# Altium project EzPowerV4 - REV09.PrjPcb (part 3 of 7)

## Sheet ESP32 WI-FI Module.SchDoc: ESP32 WI-FI Module
size A2; ApprovedBy: JTS; CheckedBy: JTS; DrawnBy: EBC; DocumentNumber: -; Revision: 09; SheetNumber: 6; SheetTotal: 7; SenaiProjectName: EzPower v4
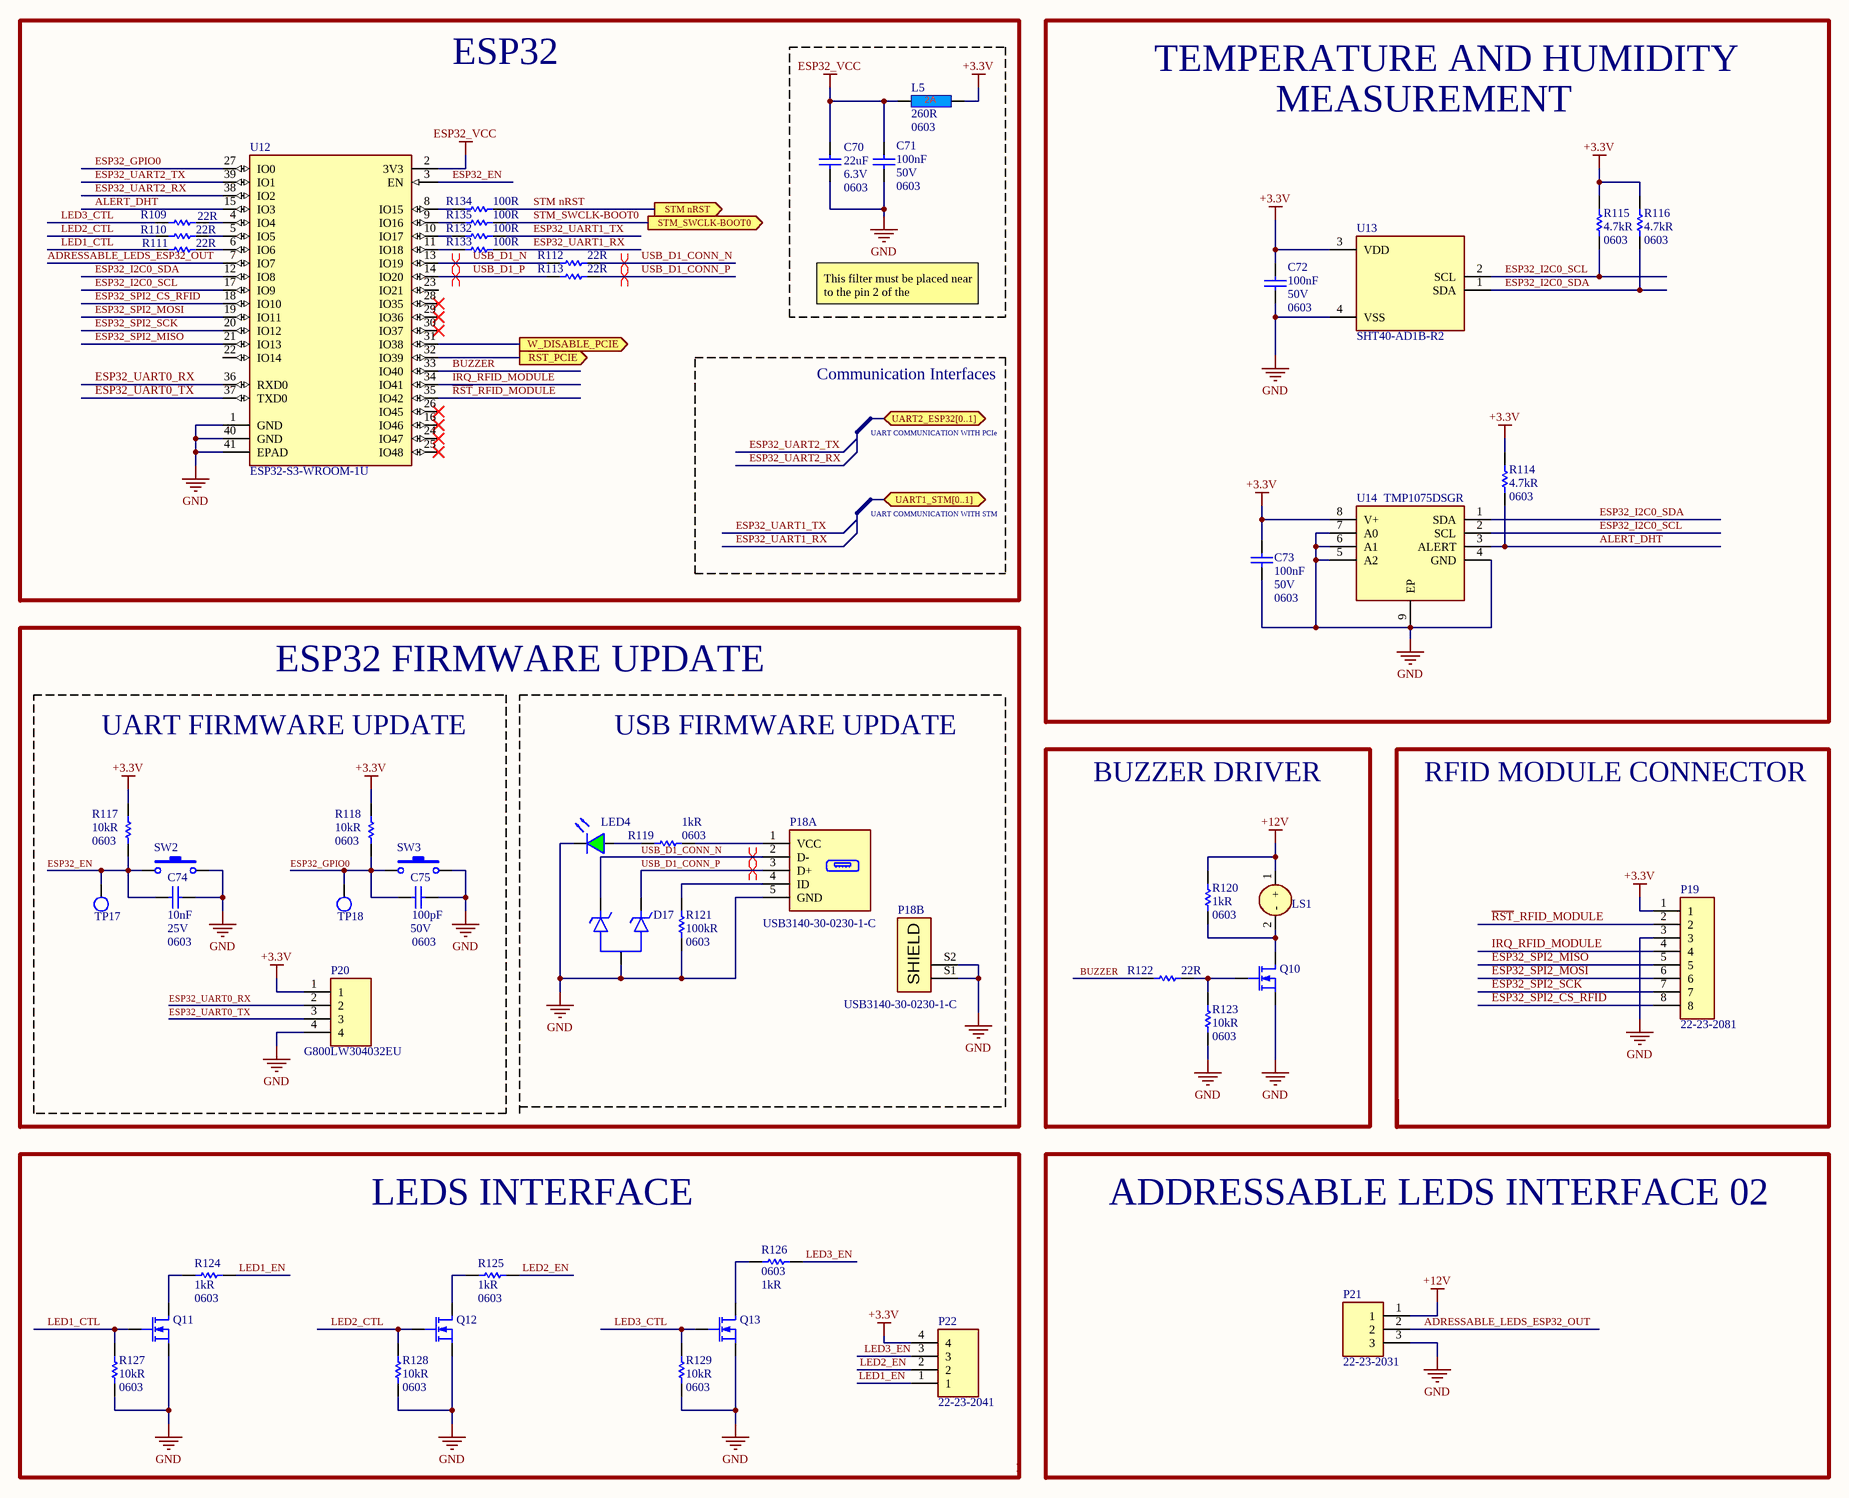
[diagram p5: ESP32 WI-FI Module.SchDoc]

### Parts
C70  Case/Package: 0603  Voltage Rating (DC): 6.3V  Capacitance: 22uF  [C0603]  (hidden comment: C_0603_22uF_6.3V_20%)
C71  value 100nF  Case/Package: 0603  Voltage Rating: 50V  [C0603]  (hidden comment: CC0603MRX7R9BB104)
C72  value 100nF  Case/Package: 0603  Voltage Rating: 50V  [C0603]  (hidden comment: CC0603MRX7R9BB104)
C73  value 100nF  Case/Package: 0603  Voltage Rating: 50V  [C0603]  (hidden comment: CC0603MRX7R9BB104)
C74  Voltage Rating: 25V  Capacitance: 10nF  Case Code (Imperial): 0603  [C0603]  (hidden comment: C_0603_0.01uF_25V_10%)
C75  value 100pF  Voltage: 50V  Case/Package: 0603  [C0603]  (hidden comment: CL10C101JB8NNNC)
D17  RCLAMP0502BATCT  [SC-75-3]  (value not drawn)
L5  Case Code: 0603  Output Impedance: 260R  [L0603]  (hidden comment: BLM18EG221SN1D)
LED4  LED 0603 SMD GREEN  [LED0603-GREEN]  (value not drawn)
LS1  PS1240P02BT  [BZ_12mm]  (value not drawn)
P18  USB3140-30-0230-1-C  [CONN-MICROUSB-VERT]  (parts A,B of 2)
P19  22-23-2081  [HEADER_KK_2.54MM_8POS]
P20  G800LW304032EU  [HEADER_2.54MM_4POS]
P21  22-23-2031  [HEADER_2.54MM_3POS]
P22  22-23-2041  [HEADER_KK_2.54MM_4POS]
Q10  RSF015N06FRATL  [TUMT-3]  (value not drawn)
Q11  RSF015N06FRATL  [TUMT-3]  (value not drawn)
Q12  RSF015N06FRATL  [TUMT-3]  (value not drawn)
Q13  RSF015N06FRATL  [TUMT-3]  (value not drawn)
R109  Resistance: 22R  [R0603]  (hidden comment: CRCW060322R0FKEAC)
R110  Resistance: 22R  [R0603]  (hidden comment: CRCW060322R0FKEAC)
R111  Resistance: 22R  [R0603]  (hidden comment: CRCW060322R0FKEAC)
R112  Resistance: 22R  [R0603]  (hidden comment: CRCW060322R0FKEAC)
R113  Resistance: 22R  [R0603]  (hidden comment: CRCW060322R0FKEAC)
R114  Case Code (Imperial): 0603  Resistance: 4.7kR  [R0603]  (hidden comment: R_0603_4.7k_1%_1/10W)
R115  Case Code (Imperial): 0603  Resistance: 4.7kR  [R0603]  (hidden comment: R_0603_4.7k_1%_1/10W)
R116  Case Code (Imperial): 0603  Resistance: 4.7kR  [R0603]  (hidden comment: R_0603_4.7k_1%_1/10W)
R117  value 10kR  Case/Package: 0603  [R0603]  (hidden comment: CRCW060310K0JNEBC)
R118  value 10kR  Case/Package: 0603  [R0603]  (hidden comment: CRCW060310K0JNEBC)
R119  Size Code: 0603  Resistance: 1kR  [R0603]  (hidden comment: R_0603_1kR_1%_1/10W)
R120  Size Code: 0603  Resistance: 1kR  [R0603]  (hidden comment: R_0603_1kR_1%_1/10W)
R121  Case/Package: 0603  Resistance: 100kR  [R0603]  (hidden comment: RC0603FR-07100KL)
R122  Resistance: 22R  [R0603]  (hidden comment: CRCW060322R0FKEAC)
R123  value 10kR  Case/Package: 0603  [R0603]  (hidden comment: CRCW060310K0JNEBC)
R124  Size Code: 0603  Resistance: 1kR  [R0603]  (hidden comment: R_0603_1kR_1%_1/10W)
R125  Size Code: 0603  Resistance: 1kR  [R0603]  (hidden comment: R_0603_1kR_1%_1/10W)
R126  Size Code: 0603  Resistance: 1kR  [R0603]  (hidden comment: R_0603_1kR_1%_1/10W)
R127  value 10kR  Case/Package: 0603  [R0603]  (hidden comment: CRCW060310K0JNEBC)
R128  value 10kR  Case/Package: 0603  [R0603]  (hidden comment: CRCW060310K0JNEBC)
R129  value 10kR  Case/Package: 0603  [R0603]  (hidden comment: CRCW060310K0JNEBC)
R132  value 100R  [R0603]  (hidden comment: CRT0603-FY-1000ELF)
R133  value 100R  [R0603]  (hidden comment: CRT0603-FY-1000ELF)
R134  value 100R  [R0603]  (hidden comment: CRT0603-FY-1000ELF)
R135  value 100R  [R0603]  (hidden comment: CRT0603-FY-1000ELF)
SW2  PTS810SJM250SMTRLFS  [PUSH BUTTON 4.2mm x 3.2 mm]  (value not drawn)
SW3  PTS810SJM250SMTRLFS  [PUSH BUTTON 4.2mm x 3.2 mm]  (value not drawn)
TP17  TP_SMT_CIRCLE  [Test Point 1.5 mm]  (value not drawn)
TP18  TP_SMT_CIRCLE  [Test Point 1.5 mm]  (value not drawn)
U12  U_ESP32-S3-WROOM-1U  [ESP32-S3-WROOM-1U]  (value not drawn)
U13  SHT40-AD1B-R2  [DFN-4]
U14  TMP1075DSGR  [WSON8]

### Blocks framed on the sheet
ESP32: C70 C71 L5 R109-R113 R132-R135 U12
ESP32 FIRMWARE UPDATE: C74 C75 P20 R117 R118 SW2 SW3 TP17 TP18
BUZZER DRIVER: LS1 Q10 R120 R122 R123
ADDRESSABLE LEDS INTERFACE 02: P21

### Ports
RST_PCIE (out), STM nRST (out), STM_SWCLK-BOOT0 (out), UART1_STM[0..1] (bidir), UART2_ESP32[0..1] (bidir), W_DISABLE_PCIE (out)

### Nets
+3.3V: C72.1 C73.1 L5.2 P19.1 P20.1 P22.4 R114.2 R115.2 R116.2 R117.2 R118.2 U13.3(VDD) U14.8(V+)
+12V: LS1.1(+) P21.1 R120.1
ESP32_VCC: C70.2 C71.1 L5.1 U12.2(3V3)
GND: C70.1 C71.2 C72.2 C73.2 C74.1 C75.2 D17.3(A) LED4.2(K) P18.5(GND) P18.S1(SHIELD) P18.S2(SHIELD) P19.3 P20.4 P21.3 Q10.2(S) Q11.2(S) Q12.2(S) Q13.2(S) R121.1 R123.1 R127.1 R128.1 R129.1 SW2.3 SW3.3 U12.1(GND) U12.40(GND) U12.41(EPAD) U13.4(VSS) U14.4(GND) U14.5(A2) U14.6(A1) U14.7(A0) U14.9(EP)  [project net EARTH]
ADRESSABLE_LEDS_ESP32_OUT: P21.2 U12.7(IO7)
ALERT_DHT: R114.1 U12.15(IO3) U14.3(ALERT)
BUZZER: R122.2 U12.33(IO40)
ESP32_EN: C74.2 R117.1 SW2.1 TP17.1 U12.3(EN)
ESP32_GPIO0: C75.1 R118.1 SW3.1 TP18.1 U12.27(IO0)
ESP32_I2C0_SCL: R115.1 U12.17(IO9) U13.2(SCL) U14.2(SCL)
ESP32_I2C0_SDA: R116.1 U12.12(IO8) U13.1(SDA) U14.1(SDA)
ESP32_SPI2_CS_RFID: P19.8 U12.18(IO10)
ESP32_SPI2_MISO: P19.5 U12.21(IO13)
ESP32_SPI2_MOSI: P19.6 U12.19(IO11)
ESP32_SPI2_SCK: P19.7 U12.20(IO12)
ESP32_UART0_RX: P20.2 U12.36(RXD0)
ESP32_UART0_TX: P20.3 U12.37(TXD0)
ESP32_UART1_RX: R133.2
ESP32_UART1_TX: R132.2
ESP32_UART2_RX: U12.38(IO2)
ESP32_UART2_TX: U12.39(IO1)
IRQ_RFID_MODULE: P19.4 U12.34(IO41)
LED1_CTL: Q11.1(G) R111.2 R127.2
LED1_EN: P22.1 R124.2
LED2_CTL: Q12.1(G) R110.2 R128.2
LED2_EN: P22.2 R125.2
LED3_CTL: Q13.1(G) R109.2 R129.2
LED3_EN: P22.3 R126.2
~{RST}_RFID_MODULE: P19.2 U12.35(IO42)
STM nRST: R134.2 ; port STM nRST
STM_SWCLK-BOOT0: R135.2 ; port STM_SWCLK-BOOT0
USB_D1_CONN_N: D17.1(K) P18.2(D-) R112.2
USB_D1_CONN_P: D17.2(K) P18.3(D+) R113.2
USB_D1_N: R112.1 U12.13(IO19)
USB_D1_P: R113.1 U12.14(IO20)
NetLED4_1: LED4.1(A) R119.2
NetLS1_2: LS1.2(-) Q10.3(D) R120.2
NetP18_1: P18.1(VCC) R119.1
NetP18_4: P18.4(ID) R121.2
NetQ10_1: Q10.1(G) R122.1 R123.2
NetQ11_3: Q11.3(D) R124.1
NetQ12_3: Q12.3(D) R125.1
NetQ13_3: Q13.3(D) R126.1
NetR21_1: U12.31(IO38) ; port W_DISABLE_PCIE
NetR24_1: U12.32(IO39) ; port RST_PCIE
NetR109_1: R109.1 U12.4(IO4)
NetR110_1: R110.1 U12.5(IO5)
NetR111_1: R111.1 U12.6(IO6)
NetR132_1: R132.1 U12.10(IO17)
NetR133_1: R133.1 U12.11(IO18)
NetR134_1: R134.1 U12.8(IO15)
NetR135_1: R135.1 U12.9(IO16)

Not connected (* = marked no-connect by the designer): U12 16(IO46)* 22(IO14) 23(IO21) 24(IO47)* 25(IO48)* 26(IO45)* 28(IO35)* 29(IO36)* 30(IO37)*

### Layout directives
differential pair: USB_D1_CONN_N, USB_D1_CONN_P, USB_D1_N, USB_D1_P

### Notes on the sheet
- TEMPERATURE AND HUMIDITY
- MEASUREMENT
- This filter must be placed near to the pin 2 of the @{"Id":"LHCKJFQH\UMNHRZPS","ObjectType":2}
- Communication Interfaces
- UART COMMUNICATION WITH PCIe
- UART COMMUNICATION WITH STM
- UART FIRMWARE UPDATE
- USB FIRMWARE UPDATE
- RFID MODULE CONNECTOR
- LEDS INTERFACE
- Title:
- Size:
- Project:
- Revision:
- Date:
- Time:
- Variant:
- Drawn by:
- Checked by:
- A2
- Approved by:
- Sheet
- of
- (in symbol L_0603_25%_2A) 2A

### Library data of the parts
C70 = C_0603_22uF_6.3V_20%: CAP CER 22UF 6.3V X5R 0603; Manufacturer: Murata; Manufacturer Part Number: GRM188R60J226MEA0J; Tolerance: 20%; Supplier 1: Digi-Key; RoHS: Yes; Category: Ceramic Capacitors; Stock 1: 150000; Pricing 1: 10000=0,03612 (USD); Mount: Surface Mount; Case Code (Metric): 1608; Weight: 0.000222oz; Min Operating Temperature: -55°C; Max Operating Temperature: 85°C; Package Quantity: 10000; Packaging: Tape and Reel; Voltage Rating: 6.3V; Dielectric: X5R; Termination: SMD/SMT; Length: 0.063inch; Width: 0.031inch; Thickness: 0.039inch; Lead Free: Lead Free; RoHS Compliant: Yes; ComponentLink1URL: https://datasheet.ciiva.com/29541/partnumbering-e-01-29541598.pdf?src-supplier=Digi-Key; ComponentLink1Description: https://datasheet.ciiva.com/29541/partnumbering-e-01-29541598.pdf?src-supplier=Digi-Key; Supplier Part Number 1: 490-7612-2-ND; Case Code (Imperial): 0603
C71-C73 = C_0603_0.1uF_50V_20%: Cap Ceramic 50V 20% +Tol 20% -Tol X7R 15% TC 0.1uF SMD 0603; Manufacturer: Yageo; Supplier 1: Arrow Electronics; Manufacturer Part Number: CC0603MRX7R9BB104; RoHS: Yes; Category: Ceramic Capacitors; Stock 1: 19775; Pricing 1: 4000=0,00850, 8000=0,00780, 12000=0,00740, 28000=0,00700, 100000=0,00520 (USD); Mounting Technology: Surface Mount; Case Code (Imperial): 0603; Case Code (Metric): 1608; Min Operating Temperature: -55°C; Max Operating Temperature: 125°C; Packaging: Tape and Reel; Tolerance: 20%; Dielectric: X7R; Voltage Rating (DC): 50V; Series: CC; Length: 0.063inch; Width: 0.031inch; Thickness: 0.035inch; Lead Free: Lead Free; Halogen Free: Halogen Free; RoHS Compliant: Yes; ComponentLink1URL: http://www.yageo.com/documents/recent/UPY-GPHC_X7R_6.3V-to-50V_18.pdf?src-supplier=Digi-Key; ComponentLink1Description: http://www.yageo.com/documents/recent/UPY-GPHC_X7R_6.3V-to-50V_18.pdf?src-supplier=Digi-Key; ComponentLink2URL: https://www.yageo.com/upload/media/product/productsearch/datasheet/mlcc/UPY-GPHC_X7R_6.3V-to-50V_18.pdf?src-supplier=Digi-Key; ComponentLink2Description: https://www.yageo.com/upload/media/product/productsearch/datasheet/mlcc/UPY-GPHC_X7R_6.3V-to-50V_18.pdf?src-supplier=Digi-Key; ComponentLink3URL: http://www.yageo.com/exep/pages/download/literatures/ProductSelectionGuide%202014_Final_2.pdf?src-supplier=Digi-Key; ComponentLink3Description: http://www.yageo.com/exep/pages/download/literatures/ProductSelectionGuide%202014_Final_2.pdf?src-supplier=Digi-Key; Supplier Part Number 1: CC0603MRX7R9BB104
C74 = C_0603_0.01uF_25V_10%: Surface Mount Ceramic Multilayer Capacitor 0.01uF 10% X7R 25V 0603 Paper T/R; Manufacturer: Yageo; Manufacturer Part Number: CC0603KRX7R8BB103; Insulation Resistance: 100GR; Supplier 1: RSComponents; RoHS: Yes; Category: Ceramic Capacitors; Stock 1: 36000; Pricing 1: 4000=0,00900, 8000=0,00800, 16000=0,00700 (GBP); Mount: Surface Mount; Case/Package: 0603; Number of Pins: 2; Case Code (Metric): 1608; Dielectric Material: Ceramic; Min Operating Temperature: -55°C; Max Operating Temperature: 125°C; Tolerance: 10%; Dielectric: X7R; Voltage Rating (DC): 25V; Packaging: Tape and Reel; Package Quantity: 1; Termination: SMD/SMT; Resistor Type: Ceramic; Voltage: 25V; Series: CC; Length: 1.6mm; Width: 0.8mm; Height: 0.8mm; Thickness: 0.035inch; Depth: 0.8mm; Radiation Hardening: No; RoHS Compliant: Yes; REACH SVHC: Unknown; Lead Free: Lead Free; Halogen Free: Halogen Free; ComponentLink1URL: https://datasheet.ciiva.com/26862/getdatasheetpartid-134630-26862833.pdf?src-supplier=Verical; ComponentLink1Description: https://datasheet.ciiva.com/26862/getdatasheetpartid-134630-26862833.pdf?src-supplier=Verical; ComponentLink2URL: https://datasheet.ciiva.com/8033/70765-8033820.pdf?src-supplier=Element14; ComponentLink2Description: https://datasheet.ciiva.com/8033/70765-8033820.pdf?src-supplier=Element14; ComponentLink3URL: https://datasheet.ciiva.com/7978/1489800-7978152.pdf?src-supplier=Element14; ComponentLink3Description: https://datasheet.ciiva.com/7978/1489800-7978152.pdf?src-supplier=Element14; ComponentLink4URL: https://datasheet.ciiva.com/28450/1489800-28450573.pdf?src-supplier=Element14; ComponentLink4Description: https://datasheet.ciiva.com/28450/1489800-28450573.pdf?src-supplier=Element14; ComponentLink5URL: https://datasheet.ciiva.com/46430/1734573-46430157.pdf?src-supplier=Element14; ComponentLink5Description: https://datasheet.ciiva.com/46430/1734573-46430157.pdf?src-supplier=Element14; ComponentLink6URL: https://datasheet.ciiva.com/8033/1734573-8033822.pdf?src-supplier=Element14; ComponentLink6Description: https://datasheet.ciiva.com/8033/1734573-8033822.pdf?src-supplier=Element14; ComponentLink7URL: https://datasheet.ciiva.com/144/mlccorderingcode-144150.pdf?src-supplier=Digi-Key; ComponentLink7Description: https://datasheet.ciiva.com/144/mlccorderingcode-144150.pdf?src-supplier=Digi-Key; ComponentLink8URL: https://datasheet.ciiva.com/144/mlccorderingcode-144149.pdf?src-supplier=Digi-Key; ComponentLink8Description: https://datasheet.ciiva.com/144/mlccorderingcode-144149.pdf?src-supplier=Digi-Key; ComponentLink9URL: https://datasheet.ciiva.com/144/mlccorderingcode-144151.pdf?src-supplier=Digi-Key; ComponentLink9Description: https://datasheet.ciiva.com/144/mlccorderingcode-144151.pdf?src-supplier=Digi-Key; ComponentLink10URL: https://datasheet.ciiva.com/11465/upy-gphc-x7r-6-3v-to-50v-8-11465198.pdf?src-supplier=Avnet; ComponentLink10Description: https://datasheet.ciiva.com/11465/upy-gphc-x7r-6-3v-to-50v-8-11465198.pdf?src-supplier=Avnet; Supplier Part Number 1: 6698814
C75 = C_0603_100pF_50V_5%: Ceramic capacitor SMD-0603 100pF /50V NP0# J +-5%, Samsung, RoHS; Tolerance: 5%; Dielectric: C0G; Temperature Coefficient: 300ppm/°C; Supplier 1: Arrow Electronics; Manufacturer: Samsung; Manufacturer Part Number: CL10C101JB8NNNC; RoHS: Yes; Category: Ceramic Capacitors; Stock 1: 768000; Pricing 1: 4000=0,0056, 8000=0,0049, 12000=0,004, 100000=0,0035, 200000=0,0031, 400000=0,0028 (USD); Mounting Technology: Surface Mount; Case Code (Metric): 1608; Case Code (Imperial): 0603; Material: Ceramic; Min Operating Temperature: -55°C; Max Operating Temperature: 125°C; Voltage Rating (DC): 50V; Packaging: Tape and Reel; Voltage Rating: 50V; Series: CL; Construction: Flat; Length: 1.6mm; Height: 0.8mm; Depth: 0.8mm; Radiation Hardening: No; Lead Free: Lead Free; RoHS Compliant: Yes; ComponentLink1URL: https://datasheet.ciiva.com/25782/cl10c101jb8nnnc-25782145.pdf?src-supplier=Digi-Key; ComponentLink1Description: https://datasheet.ciiva.com/25782/cl10c101jb8nnnc-25782145.pdf?src-supplier=Digi-Key; ComponentLink2URL: https://datasheet.ciiva.com/26838/getdatasheetpartid-358356-26838483.pdf?src-supplier=Verical; ComponentLink2Description: https://datasheet.ciiva.com/26838/getdatasheetpartid-358356-26838483.pdf?src-supplier=Verical; ComponentLink3URL: https://datasheet.ciiva.com/29199/456574-da-01-en-vs-kondensator-0603-29199002.pdf?src-supplier=Conrad; ComponentLink3Description: https://datasheet.ciiva.com/29199/456574-da-01-en-vs-kondensator-0603-29199002.pdf?src-supplier=Conrad; ComponentLink4URL: https://datasheet.ciiva.com/26310/mlcc-catalogdownload2013-eng-26310303.pdf?src-supplier=Distrelec; ComponentLink4Description: https://datasheet.ciiva.com/26310/mlcc-catalogdownload2013-eng-26310303.pdf?src-supplier=Distrelec; Supplier Part Number 1: CL10C101JB8NNNC
D17 = D_TVS_RCLAMP0502BATCT: ESD Suppressor Diode TVS Uni-Dir/Bi-Dir 5V 3-Pin SOT-523 T/R / TVS DIODE 5VWM 25VC SC75; Manufacturer: Semtech; Supplier 1: Arrow Electronics; Manufacturer Part Number: RCLAMP0502BATCT; RoHS: No; Category: TVS Diodes; Stock 1: 1022; Pricing 1: 1=0,80980, 10=0,71510, 25=0,70800, 100=0,55580, 250=0,55030, 500=0,44110, 1000=0,35410 (USD); Supplier Part Number 1: RCLAMP0502BATCT
L5 = L_0603_25%_2A: Ferrite Chip, 1 Function(s), 1A, 2 Pin(s); Manufacturer: Murata; DC Resistance-Max: 50mR; Clock Frequency: 1GHz; Min Frequency: 100MHz; Channels: 1; Supplier: Future Electronics; Supplier Part Number: 7701550; RoHS: Yes; Category: Ferrite Beads and Chips; Stock: 496000; Pricing: 4000=0,0605, 12000=0,0583, 20000=0,0573, 60000=0,0552, 100000=0,0534 (USD); Mounting Technology: Surface Mount; Material: Ferrite; Terminal Finish: Nickel; Min Operating Temperature: -55°C; Max Operating Temperature: 125°C; JESD-609 Code: e3; Construction: Chip Bead; Filter Type: FERRITE CHIP; Packaging: Tape and Reel; Length: 1.6mm; Width: 0.8mm; Height: 0.8mm; Reach SVHC Compliant: Yes; RoHS Compliant: Yes; ComponentLink1URL: https://datasheet.ciiva.com:443/pdfs/VipMasterIC/IC/MURE/MURE-S-A0008871331/MURE-S-A0008871429-1.pdf?src-supplier=IHS+Markit; ComponentLink1Description: https://datasheet.ciiva.com:443/pdfs/VipMasterIC/IC/MURE/MURE-S-A0008871331/MURE-S-A0008871429-1.pdf?src-supplier=IHS+Markit; ComponentLink2URL: https://datasheet.ciiva.com/11799/0900766b811b5866-11799010.pdf?src-supplier=Rs; ComponentLink2Description: https://datasheet.ciiva.com/11799/0900766b811b5866-11799010.pdf?src-supplier=Rs; ComponentLink3URL: https://datasheet.ciiva.com/41449/001171699-da-01-en-chip-drossel0603-220r-2000ma-1-6x0-8mm-41449376.pdf?src-supplier=Conrad; ComponentLink3Description: https://datasheet.ciiva.com/41449/001171699-da-01-en-chip-drossel0603-220r-2000ma-1-6x0-8mm-41449376.pdf?src-supplier=Conrad; ComponentLink4URL: https://datasheet.ciiva.com/41449/001172265-da-01-en-drossel-0603-220r-1-6x0-8mm-4000st-41449579.pdf?src-supplier=Conrad; ComponentLink4Description: https://datasheet.ciiva.com/41449/001172265-da-01-en-drossel-0603-220r-1-6x0-8mm-4000st-41449579.pdf?src-supplier=Conrad; ComponentLink5URL: https://datasheet.ciiva.com/1012/l0110s0101blm18e-1012872.pdf?src-supplier=Digikey; ComponentLink5Description: https://datasheet.ciiva.com/1012/l0110s0101blm18e-1012872.pdf?src-supplier=Digikey; ComponentLink6URL: https://datasheet.ciiva.com/1012/l0110s0101blm18e-1012873.pdf?src-supplier=Digikey; ComponentLink6Description: https://datasheet.ciiva.com/1012/l0110s0101blm18e-1012873.pdf?src-supplier=Digikey; ComponentLink7URL: https://datasheet.ciiva.com/1012/l0110s0101blm18e-1012874.pdf?src-supplier=Digikey; ComponentLink7Description: https://datasheet.ciiva.com/1012/l0110s0101blm18e-1012874.pdf?src-supplier=Digikey; ComponentLink8URL: https://datasheet.ciiva.com/8510/l0110s0101blm18e-8510140.pdf?src-supplier=Avnet; ComponentLink8Description: https://datasheet.ciiva.com/8510/l0110s0101blm18e-8510140.pdf?src-supplier=Avnet; ComponentLink9URL: https://datasheet.ciiva.com/14122/blm-series-eng-tds-14122908.pdf?src-supplier=Distrelec; ComponentLink9Description: https://datasheet.ciiva.com/14122/blm-series-eng-tds-14122908.pdf?src-supplier=Distrelec; ComponentLink10URL: https://datasheet.ciiva.com/16419/l0110s0101blm18e-16419148.pdf?src-supplier=Future+Electronics; ComponentLink10Description: https://datasheet.ciiva.com/16419/l0110s0101blm18e-16419148.pdf?src-supplier=Future+Electronics; ComponentLink11URL: https://datasheet.ciiva.com/1467/5169-1467157.pdf?src-supplier=Element14; ComponentLink11Description: https://datasheet.ciiva.com/1467/5169-1467157.pdf?src-supplier=Element14; ComponentLink12URL: https://datasheet.ciiva.com/1467/5169-1467158.pdf?src-supplier=Element14; ComponentLink12Description: https://datasheet.ciiva.com/1467/5169-1467158.pdf?src-supplier=Element14; Manufacturer Part Number: BLM18EG221SN1D
LED4 = LED_0603_Green: Smd, Alingap, 0603, Thin, Grn, 571Nm, 35Mcd, Clr, T/R Rohs Compliant: Yes; Manufacturer: Vishay Lite-On; Manufacturer Part Number: LTST-C191KGKT; Lens Color: Colorless; Viewing Angle: 130°; Forward Voltage: 2V; Test Current: 20mA; Lens Transparency: Clear; Wavelength: 574nm; Lens Style: Rectangular,Colorless; Forward Current: 30mA; Number of Elements: 1; Power Dissipation: 75mW; Reverse Voltage: 5V; Supplier 1: RSComponents; RoHS: Yes; Category: LEDs; Stock 1: 36950; Pricing 1: 50=0,16500, 250=0,07500, 500=0,07100, 1250=0,06000, 2500=0,05700, 50=0,11900, 250=0,05400, 500=0,05100, 1250=0,04300, 2500=0,04100 (USD); Mount: Surface Mount; Case/Package: 0603; Number of Pins: 2; Color: Green; Case Code (Metric): 1608; Case Code (Imperial): 0603; Min Operating Temperature: -55°C; Max Operating Temperature: 85°C; Luminous Intensity: 35mcd; Packaging: Tape and Reel; Package Quantity: 1; Dominant Wavelength: 571nm; Illumination Color: Green; Number of LEDs: 1; Power Rating: 75mW; Max Power Dissipation: 75mW; Length: 1.6mm; Width: 0.8mm; Height: 0.55mm; Depth: 0.8mm; Radiation Hardening: No; Lead Free: Lead Free; RoHS Compliant: Yes; ComponentLink1URL: https://datasheet.ciiva.com/2109/ltst-c191kgkt-2109973.pdf?src-supplier=Digi-Key; ComponentLink1Description: https://datasheet.ciiva.com/2109/ltst-c191kgkt-2109973.pdf?src-supplier=Digi-Key; Supplier Part Number 1: 6921010
LS1 = LS_BUZZER_12mm: Piezo Buzzers & Audio Indicators Round 12.2mmx6.5mm 4kHz Vin=3V; Manufacturer: TDK; Number of Terminals/Pins: 2; Operating Supply Voltage: 3V; Washable: No; Supplier 1: Mouser; Manufacturer Part Number: PS1240P02BT; Stock 1: 92239; Pricing 1: 1=0.6, 10=0.466, 50=0.466, 100=0.441, 1000=0.32, 10000=0.236 (USD); Mount: Through Hole; Number of Pins: 2; Min Operating Temperature: -10°C; Max Operating Temperature: 70°C; Termination: PC Pins; Package Quantity: 1; Frequency: 4kHz; Packaging: Tape and Reel; Voltage Rating (DC): 3V; Series: PS; Diameter: 12.2mm; Height: 6.5mm; Lead Free: Lead Free; RoHS Compliant: Yes; ComponentLink1URL: https://product.tdk.com/info/en/catalog/datasheets/piezoelectronic_buzzer_ps_en.pdf?src-supplier=Digi-Key; ComponentLink1Description: https://product.tdk.com/info/en/catalog/datasheets/piezoelectronic_buzzer_ps_en.pdf?src-supplier=Digi-Key; ComponentLink2URL: http://www.tdk.co.jp/tefe02/ef532_ps.pdf?src-supplier=Avnet; ComponentLink2Description: http://www.tdk.co.jp/tefe02/ef532_ps.pdf?src-supplier=Avnet; Supplier 2: Digi-Key; Supplier Part Number 1: 810-PS1240P02BT; Supplier Part Number 2: 445-2525-1-ND
P18 = P_MicroUSB_TypeB: Conn Micro USB Type B RCP 2Power/3Signal POS Solder ST SMD 5 Terminal 2 Port T/R; Manufacturer: Global Connector Technology; Gender: Receptacle; Number of Contacts: 5; USB Standard: USB 2.0; Number of Ports: 1; Mating Cycles: 10000; Shielding: Shielded; Supplier 1: Newark; RoHS: Yes; Category: USB Connectors; Stock 1: 1532; Pricing 1: 1=0,818, 10=0,721, 25=0,679, 50=0,651, 100=0,621, 250=0,565, 500=0,51 (USD); Mounting Technology: Surface Mount,Through Hole,Vertical; Contact Plating: Gold; Contact Material: Copper,Copper Alloy; Insulation Color: Black; Min Operating Temperature: -30°C; Max Operating Temperature: 85°C; Packaging: Cut Tape; Connector Type: USB; Termination: Solder; Orientation: Vertical; Series: USB3140; Reach SVHC Compliant: No; Lead Free: Lead Free; RoHS Compliant: Yes; Flammability Rating: UL94 V-0; ComponentLink1URL: https://datasheet.ciiva.com/22636/1913332-22636813.pdf?src-supplier=Element14; ComponentLink1Description: https://datasheet.ciiva.com/22636/1913332-22636813.pdf?src-supplier=Element14; Supplier Part Number 1: 84X0186; Manufacturer Part Number: USB3140-30-0230-1-C
P19 = P_Molex_HEADER_KK_8POS_2.54MM_PTH: KK 254 Solid Header, Vertical, with Friction Lock, 8 Circuits, Tin (Sn) Plating; Manufacturer: Molex; Contact Resistance: 10mR; Number of Contacts: 8; Gender: 29Gender; Max Voltage Rating (AC): 250V; Current Rating: 4A; Max Current Rating: 5A; Insulation Resistance: 500GR; Number of Circuits: 8NUMBER; Pitch: 2.54mm; Approvals: UL,CSA; Glow Wire Compliant: 16Compliance; Supplier 1: Mouser; RoHS: Yes; Category: Headers and Wire Housings; Stock 1: 17057; Pricing 1: 1=0,58, 10=0,474, 50=0,474, 100=0,367, 1000=0,313, 10000=0,263 (USD); Mounting Technology: Through Hole; Contact Plating: Tin,Copper,Gold; Contact Material: Brass,Copper Alloy; Housing Color: White; Housing Material: Nylon; Color: White; Min Operating Temperature: 0°C; Max Operating Temperature: 75°C; Orientation: Straight; Packaging: Bulk; Termination: Solder; Number of Rows: 1; Package Quantity: 4000; Series: KK® 6373; Voltage Rating: 250V; Contact Gender: Male; Number of Positions: 8; Fastening Type: Friction; Contact Type: Male Pin; Voltage Rating (DC): 250V; Length: 20.32mm; Height: 10.03mm; Depth: 6.35mm; Contact Mating Length: 0.295inch; Radiation Hardening: No; RoHS Compliant: Yes; Lead Free: 5697LeadFree; Flammability Rating: UL94 V-0; Reach SVHC Compliant: Unknown; Halogen Free: 5696HalogenFree; ComponentLink1URL: https://datasheet.ciiva.com/3933/87820022232081-pcb-headers-3933383.pdf?src-supplier=Arrow+Electronics; ComponentLink1Description: https://datasheet.ciiva.com/3933/87820022232081-pcb-headers-3933383.pdf?src-supplier=Arrow+Electronics; ComponentLink2URL: https://datasheet.ciiva.com/19462/1966288-19462362.pdf?src-supplier=Jameco; ComponentLink2Description: https://datasheet.ciiva.com/19462/1966288-19462362.pdf?src-supplier=Jameco; ComponentLink3URL: https://datasheet.ciiva.com/19472/232320-19472960.pdf?src-supplier=Jameco; ComponentLink3Description: https://datasheet.ciiva.com/19472/232320-19472960.pdf?src-supplier=Jameco; ComponentLink4URL: https://datasheet.ciiva.com/15217/getdatasheetpartid-176511-15217669.pdf?src-supplier=Verical; ComponentLink4Description: https://datasheet.ciiva.com/15217/getdatasheetpartid-176511-15217669.pdf?src-supplier=Verical; ComponentLink5URL: https://datasheet.ciiva.com/7683/1631500-7683610.pdf?src-supplier=Element14; ComponentLink5Description: https://datasheet.ciiva.com/7683/1631500-7683610.pdf?src-supplier=Element14; ComponentLink6URL: https://datasheet.ciiva.com/10086/0022232081-pcb-headers-10086317.pdf?src-supplier=Avnet; ComponentLink6Description: https://datasheet.ciiva.com/10086/0022232081-pcb-headers-10086317.pdf?src-supplier=Avnet; Supplier Part Number 1: 538-22-23-2081; Manufacturer Part Number: 22-23-2081
P20 = P_Header_2.54mm_4POS: Board to Board Connector Straight Header Single Row 4 Position 2.54mm Pitch Through Hole Bag; Manufacturer: Amphenol; Supplier 1: Mouser; RoHS: No; Category: Connectors; Stock 1: 15246; Pricing 1: 1=0,13000, 10=0,06700, 50=0,06700, 100=0,06500, 1000=0,05700, 10000=0,04700 (USD); Supplier Part Number 1: 523-G800LW304032EU; Manufacturer Part Number: G800LW304032EU
P21 = P_Molex_HEADER_3POS_2.54MM_PTH: KK 254 Solid Header, Vertical, with Friction Lock, 3 Circuits, Tin (Sn) Plating, Bag; Manufacturer: Molex; Number of Contacts: 3; Contact Resistance: 10mR; Gender: Male; Current Rating: 4A; Voltage Rating: 250V; Insulation Resistance: 500GR; Pitch: 2.54mm; Approvals: UL,CSA; Glow Wire Compliant: Non-compliant; Supplier 1: Mouser; RoHS: Yes; Category: Headers and Wire Housings; Stock 1: 71734; Pricing 1: 1=0,28000, 10=0,22400, 50=0,22400, 100=0,19700, 1000=0,16200, 10000=0,13900 (USD); Mounting Technology: Through Hole; Contact Plating: Tin,Copper; Contact Material: Brass; Color: White; Housing Color: White; Housing Material: Nylon; Min Operating Temperature: 0°C; Max Operating Temperature: 75°C; Number of Rows: 1; Termination: Solder; Orientation: Straight; Packaging: Bulk; Series: 6373; Max Current Rating: 4A; Package Quantity: 16000; Contact Gender: Male; Number of Positions: 3; Voltage Rating (DC): 250V; Number of Circuits: 3; Length: 7.62mm; Height: 10.67mm; Depth: 6.35mm; Lead Pitch: 2.54mm; Radiation Hardening: No; RoHS Compliant: Yes; Flammability Rating: UL94 V-0; Halogen Free: Low Halogen; Lead Free: Lead Free; Reach SVHC Compliant: Unknown; ComponentLink1URL: https://datasheet.ciiva.com/5158/0022232031-pcb-headers-227465-5158252.pdf?src-supplier=Mouser; ComponentLink1Description: https://datasheet.ciiva.com/5158/0022232031-pcb-headers-227465-5158252.pdf?src-supplier=Mouser; ComponentLink2URL: https://datasheet.ciiva.com/19461/1966237-19461008.pdf?src-supplier=Jameco; ComponentLink2Description: https://datasheet.ciiva.com/19461/1966237-19461008.pdf?src-supplier=Jameco; ComponentLink3URL: https://datasheet.ciiva.com/19472/232274-19472863.pdf?src-supplier=Jameco; ComponentLink3Description: https://datasheet.ciiva.com/19472/232274-19472863.pdf?src-supplier=Jameco; ComponentLink4URL: https://datasheet.ciiva.com/11746/0900766b80d8f4d1-11746118.pdf?src-supplier=Rs; ComponentLink4Description: https://datasheet.ciiva.com/11746/0900766b80d8f4d1-11746118.pdf?src-supplier=Rs; ComponentLink5URL: https://datasheet.ciiva.com/30177/930022232031-pcb-headers-30177655.pdf?src-supplier=Onlinecomponents.com; ComponentLink5Description: https://datasheet.ciiva.com/30177/930022232031-pcb-headers-30177655.pdf?src-supplier=Onlinecomponents.com; ComponentLink6URL: https://datasheet.ciiva.com/9468/0022232031-pcb-headers-9468262.pdf?src-supplier=Avnet; ComponentLink6Description: https://datasheet.ciiva.com/9468/0022232031-pcb-headers-9468262.pdf?src-supplier=Avnet; ComponentLink7URL: https://datasheet.ciiva.com/7810/1777030-7810188.pdf?src-supplier=Element14; ComponentLink7Description: https://datasheet.ciiva.com/7810/1777030-7810188.pdf?src-supplier=Element14; Supplier Part Number 1: 538-22-23-2031; Manufacturer Part Number: 22-23-2031
P22 = P_Molex_HEADER_KK_4POS_2.54MM_PTH: KK 254 Solid Header, Vertical, with Friction Lock, 4 Circuits, Tin (Sn) Plating; Manufacturer: Molex; Contact Resistance: 10mR; Number of Contacts: 4; Gender: Male; Current Rating: 4A; Max Voltage Rating (AC): 600V; Max Current Rating: 7A; Voltage Rating: 250V; Insulation Resistance: 500GR; Pitch: 2.54mm; Approvals: UL,CSA; Glow Wire Compliant: Non-compliant; Supplier 1: Mouser; RoHS: Yes; Category: Headers and Wire Housings; Stock 1: 25769; Pricing 1: 1=0,34, 10=0,22, 50=0,22, 100=0,165, 1000=0,149, 10000=0,13 (USD); Mounting Technology: Cable,Through Hole; Contact Material: Brass,Copper Alloy; Contact Plating: Tin,Copper; Housing Color: Orange; Housing Material: Nylon; Color: White; Min Operating Temperature: -55°C; Max Operating Temperature: 75°C; Termination: Through Hole; Orientation: Straight; Number of Rows: 1; Packaging: Bulk; Number of Positions: 4; Number of Circuits: 4; Series: 6373; Package Quantity: 2000; Voltage Rating (DC): 250V; Length: 19.81mm; Height: 18.42mm; Depth: 9.02mm; Radiation Hardening: No; Lead Free: Lead Free; RoHS Compliant: Yes; Halogen Free: Low Halogen; Flammability Rating: UL94 V-0; Reach SVHC Compliant: Unknown; ComponentLink1URL: https://datasheet.ciiva.com/5151/0022232041-pcb-headers-227043-5151795.pdf?src-supplier=Mouser; ComponentLink1Description: https://datasheet.ciiva.com/5151/0022232041-pcb-headers-227043-5151795.pdf?src-supplier=Mouser; ComponentLink2URL: https://datasheet.ciiva.com/11747/0900766b80d8f4d1-11747883.pdf?src-supplier=Rs; ComponentLink2Description: https://datasheet.ciiva.com/11747/0900766b80d8f4d1-11747883.pdf?src-supplier=Rs; ComponentLink3URL: https://datasheet.ciiva.com/19454/232282-19454309.pdf?src-supplier=Jameco; ComponentLink3Description: https://datasheet.ciiva.com/19454/232282-19454309.pdf?src-supplier=Jameco; ComponentLink4URL: https://datasheet.ciiva.com/19462/1966245-19462162.pdf?src-supplier=Jameco; ComponentLink4Description: https://datasheet.ciiva.com/19462/1966245-19462162.pdf?src-supplier=Jameco; ComponentLink5URL: https://datasheet.ciiva.com/7843/1896518-7843901.pdf?src-supplier=Element14; ComponentLink5Description: https://datasheet.ciiva.com/7843/1896518-7843901.pdf?src-supplier=Element14; ComponentLink6URL: https://datasheet.ciiva.com/7106/1859840-7106278.pdf?src-supplier=Newark; ComponentLink6Description: https://datasheet.ciiva.com/7106/1859840-7106278.pdf?src-supplier=Newark; ComponentLink7URL: https://datasheet.ciiva.com/16725/0022232041-pcb-headers-16725643.pdf?; ComponentLink7Description: https://datasheet.ciiva.com/16725/0022232041-pcb-headers-16725643.pdf?; Supplier Part Number 1: 538-22-23-2041
Q10-Q13 = Q_RSF015N06FRATL_TUMT-3: Transistor Mosfet N-ch 60V 1.5A 3-PIN Tumt T/r; Manufacturer: Rohm; Rds On Max: 290mR; Input Capacitance: 110pF; Max Power Dissipation: 800mW; Supplier 1: Newark; RoHS: Yes; Category: MOSFETs; Stock 1: 15; Pricing 1: 5=0,43000, 10=0,35700, 25=0,31900, 50=0,28100, 100=0,24300, 250=0,21300, 500=0,18300, 1000=0,13700 (USD); Mounting Technology: Surface Mount; Case/Package: SMD/SMT; Packaging: Tape and Reel; Drain to Source Voltage (Vdss): 60V; Continuous Drain Current (ID): 1.5A; ComponentLink1URL: http://rohmfs.rohm.com/en/products/databook/datasheet/discrete/transistor/mosfet/rsf015n06fra-e.pdf?src-supplier=Digi-Key; ComponentLink1Description: http://rohmfs.rohm.com/en/products/databook/datasheet/discrete/transistor/mosfet/rsf015n06fra-e.pdf?src-supplier=Digi-Key; Supplier Part Number 1: 24AC5315; Manufacturer Part Number: RSF015N06FRATL
R109-R113 R122 = R_0603_22R_1%_1/10W: Thick Film Resistors - SMD 1/10Watt 22ohms 1% Commercial Use; Manufacturer: Vishay; Temperature Coefficient: 100ppm/°C; Max Power Dissipation: 100mW; Supplier 1: Mouser; Manufacturer Part Number: CRCW060322R0FKEAC; Stock 1: 59616; Pricing 1: 1=0.1, 10=0.036, 100=0.014, 500=0.009, 1000=0.005, 5000=0.004 (USD); Case/Package: 0603; Case Code (Metric): 1608; Min Operating Temperature: -55°C; Max Operating Temperature: 155°C; Composition: Thick Film; Packaging: Cut Tape; Tolerance: 1%; Number of Terminations: 2; Supplier 2: Digi-Key; Supplier Part Number 1: 71-CRCW060322R0FKEAC; Supplier Part Number 2: 541-4025-6-ND; Case Code (Imperial): 0603
R114-R116 = R_0603_4.7k_1%_1/10W: Res Thick Film 0603 4.7K Ohm 1% 0.1W(1/10W) ±100ppm/C Pad SMD T/R; Manufacturer: Mitsubishi Kamaya; Manufacturer Part Number: RMC16K472FTP; Power Rating: 100mW; Voltage Rating: 50V; Number of Resistors: 1; Mount: Surface Mount; Case/Package: 0603; Case Code (Metric): 1608; Min Operating Temperature: -55°C; Max Operating Temperature: 155°C; Tolerance: 1%; Technology: THICK FILM; Supplier 1: Mouser; RoHS: No; Category: Uncategorized; Supplier Part Number 1: 791-RMC16K472FTP
R117 R118 R123 R127-R129 = R_0603_10kR_5%_1/10W: Fixed Resistor, Metal Glaze/thick Film, 0.1W, 10000ohm, 75V, 5% +/-Tol, 200ppm/Cel, Surface Mount, 0603; Manufacturer: Vishay; Power: 100mW; Temperature Coefficient: -200200ppm/°C; Package Height: 0.45mm; Package Length: 1.6mm; Package Width: 0.8mm; Supplier: Mouser; Supplier Part Number: 71-CRCW060310K0JNEBC; Manufacturer Part Number: CRCW060310K0JNEBC; RoHS: Yes; Category: Chip SMD Resistors; Stock: 170759; Pricing: 1=0,1, 10=0,014, 50=0,014, 100=0,008, 1000=0,007, 10000=0,003 (USD); Pins: 2; Terminal Finish: Nickel; Min Operating Temperature: -55°C; Max Operating Temperature: 155°C; Tolerance: 5%; JESD-609 Code: e3; Resistor Type: FIXED RESISTOR; Construction: Chip; Package Style: SMTMeter; Packaging: Tape and Reel; Technology: METAL GLAZE/THICK FILM; Working Voltage: 75V; Reach SVHC Compliant: Yes; RoHS Compliant: Yes; ComponentLink1URL: https://datasheet.ciiva.com:443/pdfs/VipMasterIC/IC/VISH/VISH-S-A0003599164/VISH-S-A0003599164-1.pdf?src-supplier=IHS+Markit; ComponentLink1Description: https://datasheet.ciiva.com:443/pdfs/VipMasterIC/IC/VISH/VISH-S-A0003599164/VISH-S-A0003599164-1.pdf?src-supplier=IHS+Markit; ComponentLink2URL: http://www.vishay.com/docs/28773/crcwce3.pdf?src-supplier=Digikey; ComponentLink2Description: http://www.vishay.com/docs/28773/crcwce3.pdf?src-supplier=Digikey
R119 R120 R124-R126 = R_0603_1kR_1%_1/10W: Res Thick Film 0603 1K Ohm 1% 1/10W ±100ppm/°C Molded SMD Paper T/R; Manufacturer: Vishay; Manufacturer Part Number: CRCW06031K00FKEAC; Power Rating: 100mW; Supplier 1: Digi-Key; RoHS: Yes; Category: Chip SMD Resistors; Stock 1: 2127199; Pricing 1: 1=0,10000, 10=0,03400, 100=0,01390, 1000=0,00624, 2500=0,00542 (USD); Mount: Surface Mount; Case/Package: Molded; Contact Plating: Tin; Min Operating Temperature: -55°C; Max Operating Temperature: 155°C; Tolerance: 1%; Resistor Type: Thick Film; Termination: Wraparound; Temperature Coefficient: 100ppm/°C; Length: 1.55mm; Lead Free: Lead Free; RoHS Compliant: Yes; ComponentLink1URL: http://www.vishay.com/docs/28773/crcwce3.pdf?src-supplier=Digi-Key; ComponentLink1Description: http://www.vishay.com/docs/28773/crcwce3.pdf?src-supplier=Digi-Key; Supplier Part Number 1: 541-3949-1-ND
R121 = R_0603_100k_1%_1/10W: Thick Film Resistors - SMD 100K OHM 1%; Manufacturer: Yageo; Temperature Coefficient: 100ppm/°C; Voltage Rating (DC): 50V; Working Voltage: 75V; Max Power Dissipation: 100mW; Supplier 1: Mouser; Manufacturer Part Number: RC0603FR-07100KL; Stock 1: 2939510; Pricing 1: 1=0,10000, 10=0,02100, 50=0,02100, 100=0,00900, 1000=0,00400, 10000=0,00300 (USD); RoHS: Yes; Number of Pins: 2; Case Code (Imperial): 0603; Case Code (Metric): 1608; Min Operating Temperature: -55°C; Max Operating Temperature: 155°C; Tolerance: 1%; Resistor Type: Thick Film; Packaging: Tape and Reel; Voltage Rating: 50V; Termination: SMD/SMT; Number of Terminations: 2; Features: Moisture Resistant; Series: RC; Resistance Tolerance: 1%; Construction: Rectangular; Technology: THICK FILM; Length: 1.6mm; Width: 0.8mm; Height: 0.45mm; Depth: 0.8mm; REACH SVHC: No SVHC; Lead Free: Lead Free; Military Standard: Not; RoHS Compliant: Yes; ComponentLink1URL: https://datasheet.ciiva.com/11808/0900766b80f96399-11808107.pdf?src-supplier=RSComponents; ComponentLink1Description: https://datasheet.ciiva.com/11808/0900766b80f96399-11808107.pdf?src-supplier=RSComponents; ComponentLink2URL: https://datasheet.ciiva.com/7983/443971-7983593.pdf?src-supplier=Element14; ComponentLink2Description: https://datasheet.ciiva.com/7983/443971-7983593.pdf?src-supplier=Element14; ComponentLink3URL: https://datasheet.ciiva.com/46440/1868787-46440889.pdf?src-supplier=Element14; ComponentLink3Description: https://datasheet.ciiva.com/46440/1868787-46440889.pdf?src-supplier=Element14; ComponentLink4URL: https://datasheet.ciiva.com/7746/1738695-7746234.pdf?src-supplier=Element14; ComponentLink4Description: https://datasheet.ciiva.com/7746/1738695-7746234.pdf?src-supplier=Element14; ComponentLink5URL: https://datasheet.ciiva.com/7746/1738695-7746235.pdf?src-supplier=Element14; ComponentLink5Description: https://datasheet.ciiva.com/7746/1738695-7746235.pdf?src-supplier=Element14; ComponentLink6URL: https://datasheet.ciiva.com/22747/443971-22747516.pdf?src-supplier=Element14; ComponentLink6Description: https://datasheet.ciiva.com/22747/443971-22747516.pdf?src-supplier=Element14; Supplier 2: Digi-Key; Supplier Part Number 1: 603-RC0603FR-07100KL; Supplier Part Number 2: 311-100KHRCT-ND; Power Rating: 100mW
R132-R135 = R_0603_100R_1%_1/10W_25PPM: Res Thin Film 0603 100 Ohm 1% 1/10W ±25ppm/°C Molded SMD Paper Tape on Plastic Reel; Manufacturer: Bourns; Max Power Dissipation: 63mW; Supplier 1: Mouser; Manufacturer Part Number: CRT0603-FY-1000ELF; RoHS: Yes; Category: Chip SMD Resistors; Stock 1: 20511; Pricing 1: 1=0,17000, 10=0,15600, 50=0,15600, 100=0,06000, 1000=0,02700, 10000=0,01800 (USD); Package Quantity: 5000; Packaging: Tape and Reel; Tolerance: 1%; Resistor Type: Thin Film; Number of Terminations: 2; Temperature Coefficient: 25ppm/°C; Length: 0.061inch; Width: 0.031inch; Height: 0.024inch; ComponentLink1URL: http://www.bourns.com/docs/Product-Datasheets/crt.pdf?src-supplier=Digi-Key; ComponentLink1Description: http://www.bourns.com/docs/Product-Datasheets/crt.pdf?src-supplier=Digi-Key; Supplier Part Number 1: 652-CRT0603FY1000ELF
SW2 SW3 = B_PushButton_PTS810SJM250SMTRLFS: SWITCHTACTILESPST-NO0.05A16V; Manufacturer: ITT C&K; Mechanical Life: 150000Cycles; Operating Force: 160gf; Throw Configuration: SPST; Current Rating: 50mA; Voltage Rating (DC): 16V; Illumination Type: Non-Illuminated; Switch Travel: 0.15mm; Switch Function: Off-Mom; Actuator Type: Standard; Supplier 1: Rs; RoHS: Yes; Category: Uncategorized; Stock 1: 152; Pricing 1: 1=165,28000 (GBP); Mounting Technology: Surface Mount; Case/Package: SMD/SMT; Color: Black; Contact Plating: Silver; Min Operating Temperature: -40°C; Max Operating Temperature: 85°C; Packaging: Tape and Reel; Termination: J-Bend; Package Quantity: 2900; Max Current Rating: 50mA; Orientation: Straight; Length: 3.2mm; Depth: 4.6mm; Lead Free: Lead Free; RoHS Compliant: Yes; ComponentLink1URL: https://datasheet.ciiva.com/24082/pts810-4mar13-248115-24082262.pdf?src-supplier=Mouser; ComponentLink1Description: https://datasheet.ciiva.com/24082/pts810-4mar13-248115-24082262.pdf?src-supplier=Mouser; ComponentLink2URL: https://datasheet.ciiva.com/18514/pts810-4mar13-18514059.pdf?src-supplier=Digi-Key; ComponentLink2Description: https://datasheet.ciiva.com/18514/pts810-4mar13-18514059.pdf?src-supplier=Digi-Key; ComponentLink3URL: https://datasheet.ciiva.com/18514/pts810-4mar13-18514060.pdf?src-supplier=Digi-Key; ComponentLink3Description: https://datasheet.ciiva.com/18514/pts810-4mar13-18514060.pdf?src-supplier=Digi-Key; ComponentLink4URL: https://datasheet.ciiva.com/18514/pts810-4mar13-18514058.pdf?src-supplier=Digi-Key; ComponentLink4Description: https://datasheet.ciiva.com/18514/pts810-4mar13-18514058.pdf?src-supplier=Digi-Key; Supplier Part Number 1: 1769461; Manufacturer Part Number: PTS810SJM250SMTRLFS
U12 = U_ESP32-S3-WROOM-1U: Multiprotocol Modules SMD Module, ESP32-S3R8, 8 MB Octal PSRAM Die, 16 MB Quad SPI Flash, IPEX Antenna Connector; Manufacturer Part Number: ESP32-S3-WROOM-1U-N16R8; MF: Espressif Systems; SnapEDA_Link: https://www.snapeda.com/parts/ESP32-S3-WROOM-1U/Espressif+Systems/view-part/?ref=snap; Availability: Not in stock; Package: Package; Price: None; Value: *; Check_prices: https://www.snapeda.com/parts/ESP32-S3-WROOM-1U/Espressif+Systems/view-part/?ref=eda; Supplier 1: Mouser; Manufacturer: Espressif Systems; RoHS: No; Stock 1: 2884; Pricing 1: 1=4,20000, 10=4,20000, 50=4,20000, 100=4,20000, 1000=4,20000, 10000=4,20000 (USD); Supplier Part Number 1: 356-ESP32S3WM1UN16R8; MP: ESP32-S3-WROOM-1U
U13 = U_SHT40-AD1B-R2_DFN-4: Humidity/Temperature Sensor Digital Serial (I2C) 4-Pin DFN EP T/R; Manufacturer: Sensirion; Supplier 1: Mouser; RoHS: Yes; Category: Temperature and Humidity Sensors; Stock 1: 79569; Pricing 1: 1=2,70000, 10=1,66000, 50=1,66000, 100=1,58000, 1000=1,25000, 10000=1,14000 (USD); Supplier Part Number 1: 403-SHT40-AD1B-R2; Manufacturer Part Number: SHT40-AD1B-R2
U14 = U_TMP1075DSGR_WSON-8: 1°C I2C Temperature sensor with performance upgrades to industry standard LM75 / TMP75 8-WSON -55 to 125; Manufacturer: Texas Instruments; Supplier 1: Mouser; RoHS: Yes; Category: Integrated Circuits (ICs); Stock 1: 25726; Pricing 1: 1=0,69000, 10=0,57000, 50=0,41600, 100=0,35500, 1000=0,23700, 10000=0,23600 (USD); ComponentLink1URL: http://www.ti.com/general/docs/suppproductinfo.tsp?distId=10&amp;gotoUrl=http%3A%2F%2Fwww.ti.com%2Flit%2Fgpn%2Ftmp1075&src-supplier=Digi-Key; ComponentLink1Description: http://www.ti.com/general/docs/suppproductinfo.tsp?distId=10&amp;gotoUrl=http%3A%2F%2Fwww.ti.com%2Flit%2Fgpn%2Ftmp1075&src-supplier=Digi-Key; Supplier Part Number 1: 595-TMP1075DSGR; Manufacturer Part Number: TMP1075DSGR